# EAGLE design CCM_0020_transmitter (EAGLE 9.5.1)

## Sheet 1 of 2: transmitter
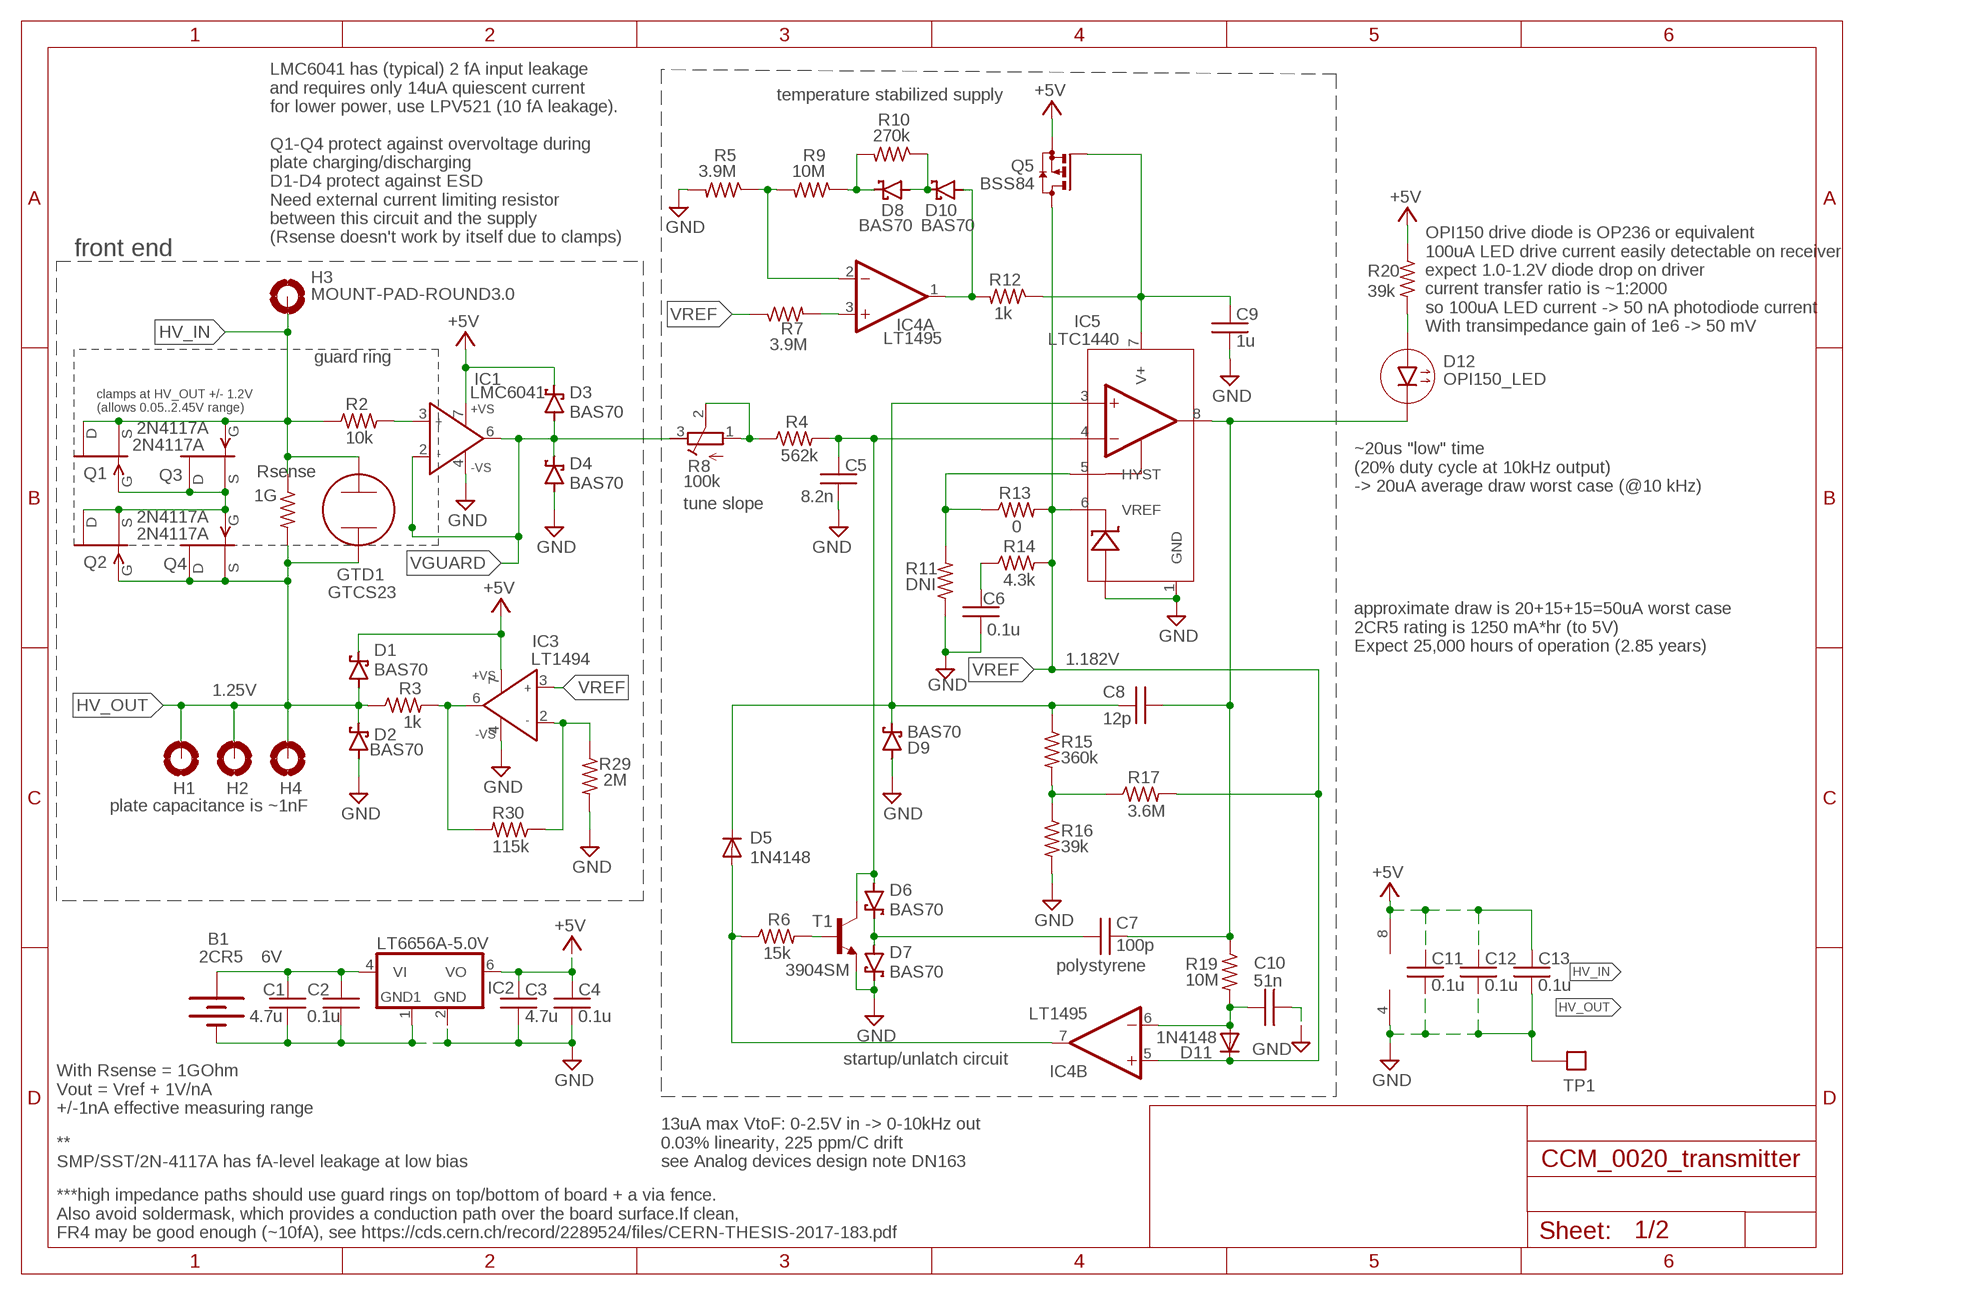
[diagram p0: schematic, sheet 1]

### Parts
B1  2CR5  BATTERY  [2CR5]
C1  4.7u  C0603  [0603]
C2  0.1u  C0603  [0603]
C3  4.7u  C0603  [0603]
C4  0.1u  C0603  [0603]
C5  8.2n  C0603  [0603]
C6  0.1u  C0603  [0603]
C7  100p  C0603  [0603]
C8  12p  C0603  [0603]
C9  1u  C0603  [0603]
C10  51n  C0603  [0603]
C11  0.1u  C0603  [0603]
C12  0.1u  C0603  [0603]
C13  0.1u  C0603  [0603]
D1  BAS70  [SOT23]
D2  BAS70  [SOT23]
D3  BAS70  [SOT23]
D4  BAS70  [SOT23]
D5  1N4148  [SOD323_ST]
D6  BAS70  [SOT23]
D7  BAS70  [SOT23]
D8  BAS70  [SOT23]
D9  BAS70  [SOT23]
D10  BAS70  [SOT23]
D11  1N4148  [SOD323_ST]
D12  OPI150_LED  [OPI150_LED]
GTD1  GTCS23  [GTCS23]
H1  MOUNT-PAD-ROUND3.0  [3,0-PAD]
H2  MOUNT-PAD-ROUND3.0  [3,0-PAD]
H3  MOUNT-PAD-ROUND3.0  [3,0-PAD]
H4  MOUNT-PAD-ROUND3.0  [3,0-PAD]
IC1  LMC6041  AD825_A  [SO08]
IC2  LT6656A-5.0V  LT6656  [SOT23-6]
IC3  LT1494  AD825_A  [SO08]
IC4  LT1495  LM393D  [SO08]
IC5  LTC1440  [SO8]
Q1  2N4117A  SST5484  [SOT23]
Q2  2N4117A  SST5484  [SOT23]
Q3  2N4117A  SST5484  [SOT23]
Q4  2N4117A  SST5484  [SOT23]
Q5  BSS84  [SOT23]
R1  1G  RESISTOR2512  [2512]
R2  10k  R0603  [0603]
R3  1k  R0603  [0603]
R4  562k  R0603  [0603]
R5  3.9M  R0603  [0603]
R6  15k  R0603  [0603]
R7  3.9M  R0603  [0603]
R8  100k  R-TRIMM3224W  [RTRIM3224W]
R9  10M  R0603  [0603]
R10  270k  R0603  [0603]
R11  DNI  R0603  [0603]
R12  1k  R0603  [0603]
R13  0  R0603  [0603]
R14  4.3k  R0603  [0603]
R15  360k  R0603  [0603]
R16  39k  R0603  [0603]
R17  3.6M  R0603  [0603]
R19  10M  R0603  [0603]
R20  39k  R0603  [0603]
R29  2M  R0603  [0603]
R30  115k  R0603  [0603]
T1  3904SM  [SOT23]
TP1  TESTPOINT  [TESTPOINT]

### Nets
+5V: C3.1 C4.1 C11.1 C12.1 C13.1 D1.3(C) D3.3(C) IC1.7(+VS) IC2.6(VO) IC3.7(+VS) IC4.8(P:V+) Q5.2(S) R20.1
GND: B1.V-(-) C1.2 C2.2 C3.2 C4.2 C5.2 C6.1 C9.2 C10.2 C11.2 C12.2 C13.2 D2.1(A) D4.1(A) D7.3(C) D9.1(A) IC1.4(-VS) IC2.1(GND1) IC2.2(GND) IC3.4(-VS) IC4.4(P:V-) IC5.1(GND) IC5.2(V-) R5.2 R11.1 R16.2 R29.2 T1.2(E) TP1.P$1
HV_IN: GTD1.P$1 H3.B3,0(MOUNT) Q1.1(D) Q1.2(S) Q3.3(G) R1.1 R2.1
HV_IN1: Q1.3(G) Q2.1(D) Q2.2(S) Q3.1(D) Q3.2(S) Q4.3(G)
HV_OUT: D1.1(A) D2.3(C) GTD1.P$2 H1.B3,0(MOUNT) H2.B3,0(MOUNT) H4.B3,0(MOUNT) Q2.3(G) Q4.1(D) Q4.2(S) R1.2 R3.1
HYST: IC5.5(HYST) R11.2 R13.1
N$2: C9.1 IC5.7(V+) Q5.1(G) R12.1
N$3: D12.P$1(1(A)) R20.2
N$6: R4.1 R8.1(A) R8.2(S)
N$7: IC1.3(IN+) R2.2
N$9: C6.2 R14.1
N$10: C5.1 D6.1(A) IC5.4(-IN) R4.2 T1.3(C)
N$11: C7.1 D6.3(C) D7.1(A)
N$12: R6.2 T1.1(B)
N$13: D5.A IC4.7(B:OUT) R6.1
N$14: R15.2 R16.1 R17.1
N$15: C8.1 D5.C D9.3(C) IC5.3(+IN) R15.1
N$16: C10.1 D11.A IC4.6(B:-IN) R19.2
N$18: D8.1(A) D10.3(C) R10.1
N$19: D8.3(C) R9.1 R10.2
N$20: IC4.2(A:-IN) R5.1 R9.2
N$22: B1.V+(+) C1.1 C2.1 IC2.4(VI)
N$23: D10.1(A) IC4.1(A:OUT) R12.2
N$25: IC4.3(A:+IN) R7.2
N$27: IC3.2(IN-) R29.1 R30.1
N$28: IC3.6(OUT) R3.2 R30.2
VGUARD: D3.1(A) D4.3(C) IC1.2(IN-) IC1.6(OUT) R8.3(E)
VREF: D11.C IC3.3(IN+) IC4.5(B:+IN) IC5.6(VREF) Q5.3(D) R7.1 R13.2 R14.2 R17.2
VTOF_OUTPUT: C7.2 C8.2 D12.P$2(2(C)) IC5.8(OUT) R19.1

### Notes on the sheet
- temperature stabilized supply
- LMC6041 has (typical) 2 fA input leakage
  and requires only 14uA quiescent current
  for lower power, use LPV521 (10 fA leakage).
  
  Q1-Q4 protect against overvoltage during 
  plate charging/discharging  
  D1-D4 protect against ESD
  Need external current limiting resistor
  between this circuit and the supply
  (Rsense doesn't work by itself due to clamps)
- front end
- OPI150 drive diode is OP236 or equivalent
  100uA LED drive current easily detectable on receiver
  expect 1.0-1.2V diode drop on driver
  current transfer ratio is ~1:2000
  so 100uA LED current -> 50 nA photodiode current
  With transimpedance gain of 1e6 -> 50 mV
- guard ring
- clamps at HV_OUT +/- 1.2V
  (allows 0.05..2.45V range)
- Rsense
- ~20us "low" time
  (20% duty cycle at 10kHz output)
  -> 20uA average draw worst case (@10 kHz)
- tune slope
- approximate draw is 20+15+15=50uA worst case
  2CR5 rating is 1250 mA*hr (to 5V)
  Expect 25,000 hours of operation (2.85 years)
- 1.182V
- 1.25V
- plate capacitance is ~1nF
- 6V
- polystyrene
- startup/unlatch circuit
- With Rsense = 1GOhm
  Vout = Vref + 1V/nA
  +/-1nA effective measuring range
- **
  SMP/SST/2N-4117A has fA-level leakage at low bias
- 13uA max VtoF: 0-2.5V in -> 0-10kHz out
  0.03% linearity, 225 ppm/C drift
  see Analog devices design note DN163
- ***high impedance paths should use guard rings on top/bottom of board + a via fence.  
  Also avoid soldermask, which provides a conduction path over the board surface.If clean, 
  FR4 may be good enough (~10fA), see https://cds.cern.ch/record/2289524/files/CERN-THESIS-2017-183.pdf

## Sheet 2 of 2: receiver
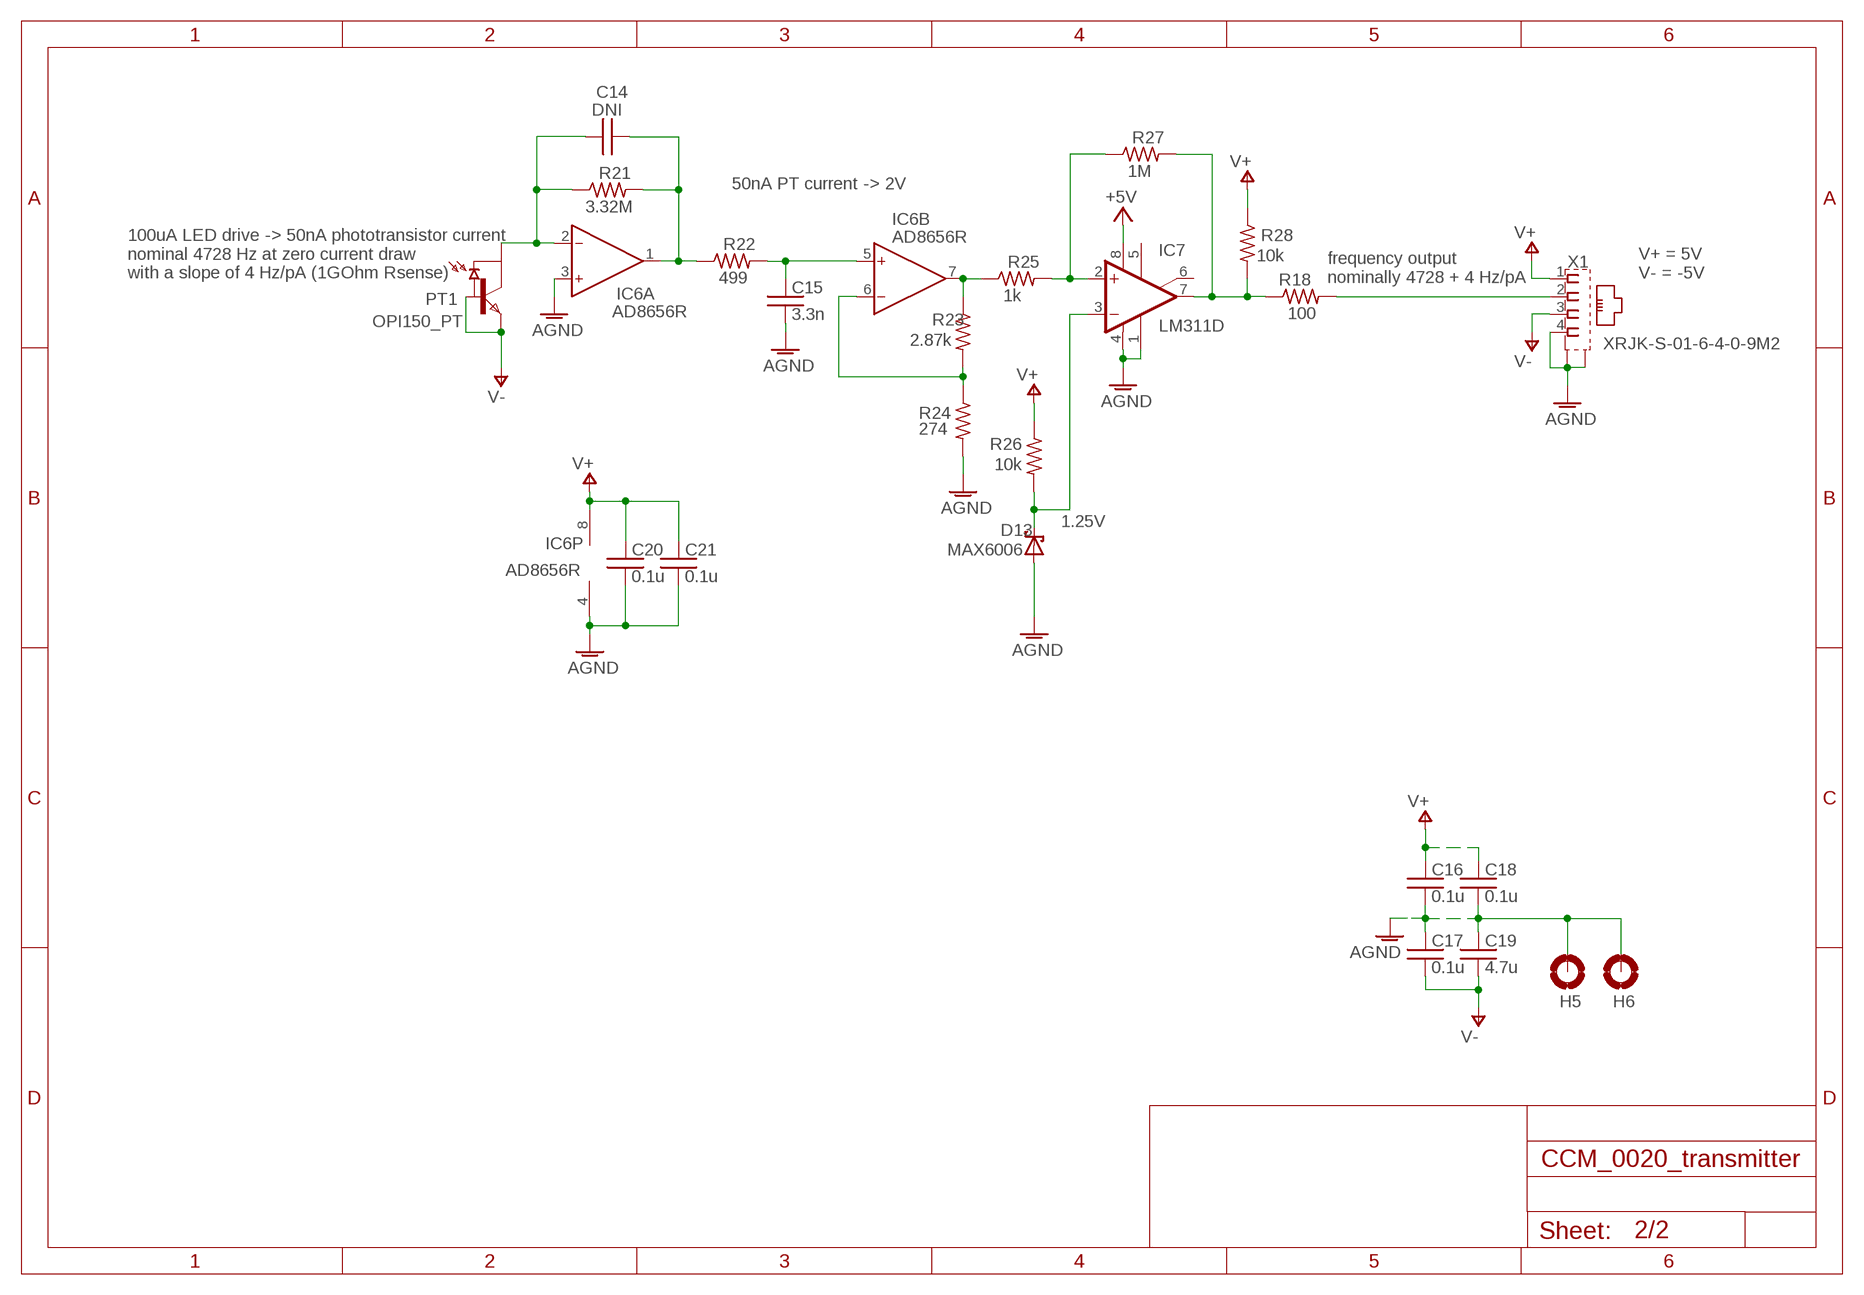
[diagram p1: schematic, sheet 2]

### Parts
C14  DNI  C0603  [0603]
C15  3.3n  C0603  [0603]
C16  0.1u  C0603  [0603]
C17  0.1u  C0603  [0603]
C18  0.1u  C0603  [0603]
C19  4.7u  C0603  [0603]
C20  0.1u  C0603  [0603]
C21  0.1u  C0603  [0603]
D13  MAX6006  LM4040  [SOT23]
H5  MOUNT-PAD-ROUND3.0  [3,0-PAD]
H6  MOUNT-PAD-ROUND3.0  [3,0-PAD]
IC6  AD8656R  [SO8]
IC7  LM311D  [SO08]
PT1  OPI150_PT  OPI150_PHOTOTRANSISTOR  [OPI150_PHOTOTRANSISTOR]
R18  100  R0603  [0603]
R21  3.32M  R0603  [0603]
R22  499  R0603  [0603]
R23  2.87k  R0603  [0603]
R24  274  R0603  [0603]
R25  1k  R0603  [0603]
R26  10k  R0603  [0603]
R27  1M  R0603  [0603]
R28  10k  R0603  [0603]
X1  XRJK-S-01-6-4-0-9M2  [XRJK-S-01-6-4-0-9M2]

### Nets
AGND: C15.2 C16.2 C17.1 C18.2 C19.1 C20.2 C21.2 D13.2(A) H5.B3,0(MOUNT) H6.B3,0(MOUNT) IC6.3(A:IN+) IC6.4(P:V-) IC7.1(GND) IC7.4(V-) R24.2 X1.4 X1.S1(S) X1.S2(S)
FOUT: IC7.7(OUT) R18.1 R27.2 R28.2
N$1: R18.2 X1.2
N$4: C14.1 IC6.2(A:IN-) PT1.P3(COLLECTOR) R21.1
N$5: C14.2 IC6.1(A:OUT) R21.2 R22.1
N$8: C15.1 IC6.5(B:IN+) R22.2
N$17: IC6.6(B:IN-) R23.2 R24.1
N$21: IC6.7(B:OUT) R23.1 R25.1
N$24: IC7.2(+IN) R25.2 R27.1
N$26: D13.1(C) IC7.3(-IN) R26.2
V+: C16.1 C18.1 C20.1 C21.1 IC6.8(P:V+) IC7.8(V+) R26.1 R28.1 X1.1 ; supply symbol labelled +5V
V-: C17.2 C19.2 PT1.P4(BASE) PT1.P5(EMITTER) X1.3
Unconnected: IC7.5(ON) IC7.6(ON/STR)

### Notes on the sheet
- 50nA PT current -> 2V
- 100uA LED drive -> 50nA phototransistor current
  nominal 4728 Hz at zero current draw
  with a slope of 4 Hz/pA (1GOhm Rsense)
- V+ = 5V
  V- = -5V
- frequency output
  nominally 4728 + 4 Hz/pA
- 1.25V

## Library data of the parts
B1 = noah:BATTERY
C1-C21 = acrooptics:C: Capacitor
D1-D4 D6-D10 = diode:BAS70: Silicon Schottky Diodes General-purpose diode for high-speed switching
D5 D11 = custom_parts:1N4148: DIODE high speed (Philips)
D12 = noah:OPI150_LED
D13 = noah:LM4040: LM4040 Reference Zener Diode
GTD1 = noah:GTCS23
H1-H6 = holes:MOUNT-PAD-ROUND: MOUNTING PAD, round
IC1 IC3 = noah:AD825_A: Low Cost, General-Purpose High Speed JFET Amplifier Source: http://www.analog.com/static/imported-files/data_sheets/AD825.pdf
IC2 = noah:LT6656
IC4 = linear:LM393: COMPARATOR
IC5 = noah:LTC1440
IC6 = analog-devices:AD8656: Low Noise, Precision CMOS Amplifier Source: http://www.analog.com/static/imported-files/data_sheets/AD8655_8656.pdf; MPN: AD8656ARZ; OC_FARNELL: 1117887; OC_NEWARK: 19M0993
IC7 = linear:LM311: COMPARATOR
PT1 = noah:OPI150_PHOTOTRANSISTOR
Q1-Q4 = transistor-fet:?548*: N-Channel JFETs Source: VISHAY 2N5484.pdf Compatible: TO92 2N5245 J304 J305 U310 J308 J309 J310 TO72 2N4416 2N4416A 2N3823 2N4351 3N169 3N170 3N171 MFE3002 TO18 2N3796 2N3797 MFE825 Source: Motorola European Master Guide Pacge 3-59
Q5 = transistor-small-signal:BSS84: P-CHANNEL MOS FET
R1 = noah:RESISTOR: RESISTOR, American symbol
R2-R7 R9-R30 = acrooptics:R: 0603 resistor
R8 = rcl:R-TRIMM: Trimm resistor; SPICEMODEL: X; SPICEPREFIXL: POT
T1 = noah:3904: NPN TRANSISTOR
TP1 = noah:TESTPOINT
X1 = con-xmultiple:XRJK*4: RJ11 Connector without LED, 6 position, 4 contacts, thrue hole Source: XRJK-S-01-6-4-0-9M2(01).pdf

## Net classes
1 standard: width 0.61 mm, clearance 0.254 mm
2 shield: width 0.61 mm, clearance 0.635 mm

## Board
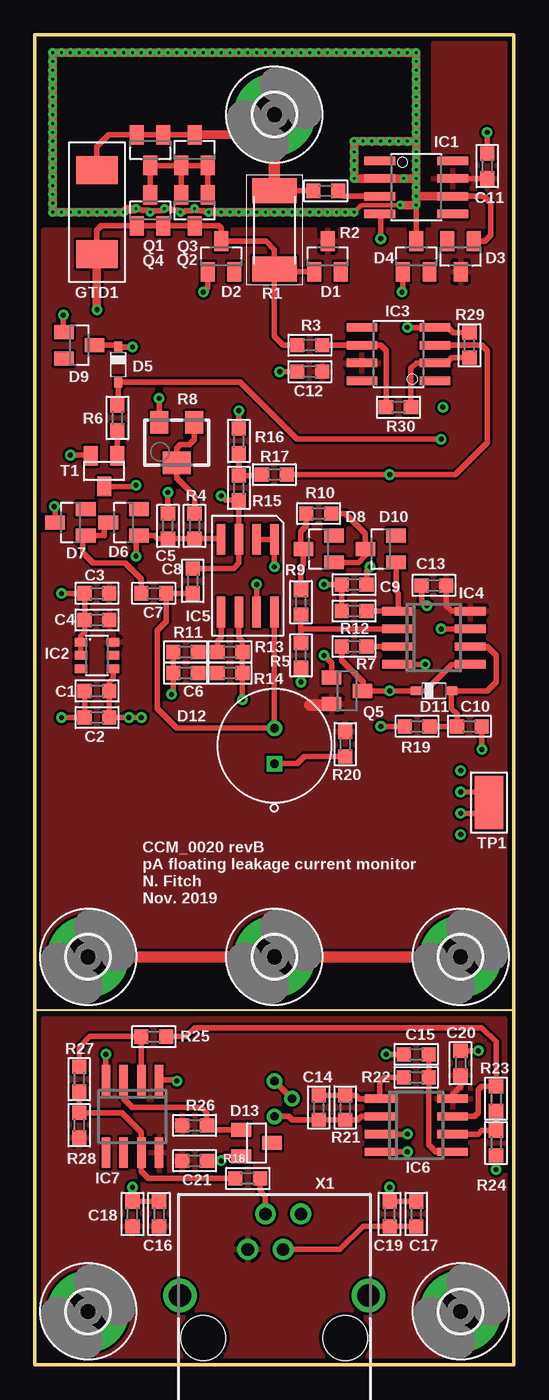
[diagram p2: board, top side]
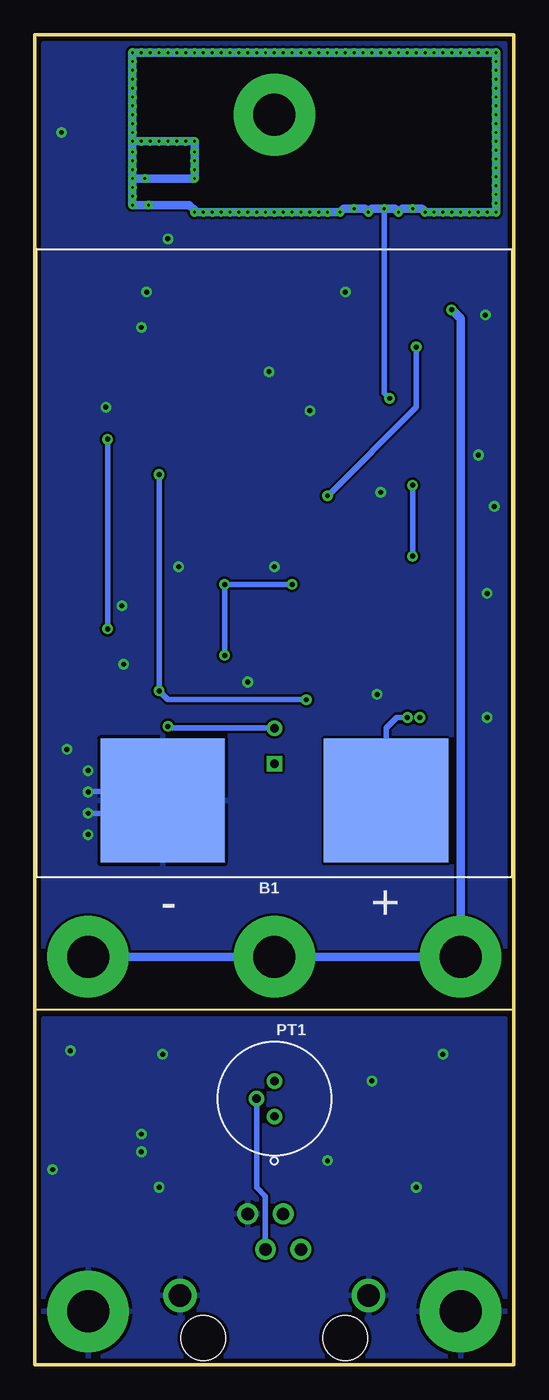
[diagram p3: board, bottom side, seen from below]

Size 34.29 x 95.25 mm. Coordinates in mm from the lower left corner, seen from the top.
Outline: 0,25.4 0,95.25 34.29,95.25 34.29,25.4
Outline: 0,25.4 0,0 34.29,0 34.29,25.4
Outline: 0,25.4 34.29,25.4
Copper layers (1*16): Top 0.035mm / dielectric 1.5mm / Bottom 0.035mm
Design rules "default *": minimum track width 10mil, minimum drill 8mil, track to track 7mil, track to pad 7mil, pad to pad 7mil, via to via 7mil, smd to smd 7mil, copper to edge 10mil, drill to drill 8mil, minimum pad ring 10mil, minimum via ring 8mil, stop-mask expansion 4mil, vias tented up to drill 0mil, thermal gap 10mil

### Footprints (pad centres in the part's own frame; a part is rotated, then mirrored left to right if it is on the bottom)
2CR5 = smd 8.89 x 8.89: V+ -8,17; V- 8,17
0603 = smd 1.016 x 1.016: 1 -0.889,0; 2 0.889,0
SOT23 = smd 1 x 1.4: 1 -0.95,-1.1; 2 0.95,-1.1; 3 0,1.1
SOD323_ST = smd 0.8 x 0.6: A 1.25,0; C -1.25,0
OPI150_LED = drill 0.6 square: P$1 0,1.27 | drill 0.6: P$2 0,-1.27
GTCS23 = smd 2 x 3: P$1 -3,0; P$2 3,0
3,0-PAD = drill 3 pad 5.842: B3,0 0,0
SO08 = smd 0.61 x 2.21: 1 -1.905,-2.616; 2 -0.635,-2.616; 3 0.635,-2.616; 4 1.905,-2.616; 5 1.905,2.616; 6 0.635,2.616; 7 -0.635,2.616; 8 -1.905,2.616
SOT23-6 = smd 0.6 x 0.9: 1 -0.95,-1.15; 2 0,-1.15; 3 0.95,-1.15; 4 0.95,1.15; 5 0,1.15; 6 -0.95,1.15
SO08' = smd 0.6 x 2.2: 1 -1.905,-2.6; 2 -0.635,-2.6; 3 0.635,-2.6; 4 1.905,-2.6; 5 1.905,2.6; 6 0.635,2.6; 7 -0.635,2.6; 8 -1.905,2.6
SO8 = smd 0.6 x 2.2: 1 -1.905,-2.6; 2 -0.635,-2.6; 3 0.635,-2.6; 4 1.905,-2.6; 5 1.905,2.6; 6 0.635,2.6; 7 -0.635,2.6; 8 -1.905,2.6
OPI150_PHOTOTRANSISTOR = drill 0.6: P3 0,1.27; P4 1.27,0; P5 0,-1.27
2512 = smd 1.8 x 3.2: 1 -2.8,0; 2 2.8,0
RTRIM3224W = smd 1.3 x 1.6: 1 -1.25,-1.45; 3 1.25,-1.45 | smd 2 x 1.6: 2 0,1.45
TESTPOINT = smd 3.81 x 2.032: P$1 0,0
XRJK-S-01-6-4-0-9M2 = drill 0.9 pad 1.5: 1 -1.905,6.35; 2 -0.635,8.89; 3 0.635,6.35; 4 1.905,8.89 | drill 1.6 pad 2.184: S1 -6.75,3.05; S2 6.75,3.05 | hole 3.2: -5.08,0; 5.08,0

### Placement (x,y rotation side)
B1  17.14,57.4 180 bottom
C1  4.45,48.26 180 top
C2  4.45,46.35 180 top
C3  4.45,55.24 180 top
C4  4.45,53.34 180 top
C5  9.53,60.07 90 top
C6  10.79,49.53 0 top
C7  8.51,55.24 0 top
C8  11.3,56.13 270 top
C9  22.86,55.88 0 top
C10  31.11,45.72 0 top
C11  32.38,85.85 90 top
C12  19.68,71.12 180 top
C13  28.57,55.82 180 top
C14  20.32,18.41 90 top
C15  27.3,22.22 180 top
C16  8.89,10.79 90 top
C17  27.3,10.79 270 top
C18  6.99,10.79 90 top
C19  25.4,10.79 270 top
C20  30.48,21.59 90 top
C21  11.43,14.6 0 top
D1  20.95,79.38 0 top
D2  13.34,79.38 0 top
D3  30.48,79.38 180 top
D4  27.3,79.38 0 top
D5  5.97,71.63 270 top
D6  6.35,60.32 90 top
D7  2.54,60.32 90 top
D8  20.32,58.42 90 top
D9  3.17,73.03 270 top
D10  24.77,58.42 90 top
D11  28.57,48.26 0 top
D12  17.14,44.32 180 top
D13  15.88,15.87 270 top
GTD1  4.45,82.55 270 top
H1  30.48,29.21 0 top
H2  3.81,29.21 0 top
H3  17.14,89.53 0 top
H4  17.14,29.21 0 top
H5  30.48,3.81 0 top
H6  3.81,3.81 0 top
IC1  27.3,84.33 270 top
IC2  4.45,50.8 270 top
IC3  26.04,72.39 90 top
IC4  LT1495  [SO08']  28.57,52.07 270 top
IC5  15.24,56.52 180 top
IC6  27.3,17.14 270 top
IC7  LM311D  [SO08']  6.99,17.78 180 top
PT1  17.14,19.05 180 bottom
Q1  8.26,87 180 top
Q2  11.43,82.68 180 top
Q3  11.43,87 0 top
Q4  8.26,82.68 0 top
Q5  22.35,48.26 270 top
R1  17.14,81.28 270 top
R2  20.83,84.07 0 top
R3  19.68,73.03 0 top
R4  11.43,60.07 270 top
R5  19.05,50.8 270 top
R6  5.91,67.82 270 top
R7  22.86,51.44 0 top
R8  10.16,66.04 180 top
R9  19.05,54.61 270 top
R10  20.32,60.96 180 top
R11  10.79,51.05 0 top
R12  22.86,53.97 0 top
R13  13.97,51.05 0 top
R14  13.97,49.53 0 top
R15  14.61,62.8 90 top
R16  14.61,66.17 90 top
R17  17.14,63.75 0 top
R18  15.24,13.33 0 top
R19  27.37,45.72 0 top
R20  22.23,44.45 270 top
R21  22.23,18.41 90 top
R22  27.3,20.57 0 top
R23  33.02,19.05 270 top
R24  33.02,15.87 270 top
R25  8.51,23.49 180 top
R26  11.43,17.14 0 top
R27  3.17,20.45 270 top
R28  3.17,17.14 90 top
R29  31.11,73.03 90 top
R30  26.04,68.58 180 top
T1  4.95,64.01 180 top
TP1  32.51,40.26 90 top
X1  17.14,1.9 0 top

### Tracks (layer width: path | path; a pad name or v marks a point on that pad's centre or on a via)
+5V
  Top 0.406: C13.1 29.46,54.36 29.84,53.97 IC4.8 | IC1.7 C11.1
  Top 0.813: Q5.2 21.19,47.24 19.68,47.24
  pour Top: 0.64,26.04 0.64,81.28 28.57,81.28 28.57,94.62 33.66,94.62 33.66,26.04
AGND  (via drill 0.35)
  Top 0.406: D13.2 13.65,14.92 v13.34,14.6 C21.2 | R24.2 v33.02,13.97 | C20.2 v31.75,22.48 | IC6.3 v26.67,16.51 | IC6.4 v26.67,15.24 | C17.1 C19.1 v25.4,12.7 | C16.2 C18.2 v6.99,12.7 | IC7.1 10.1,20.38 v10.16,20.32 | IC7.4 v5.08,22.22 | C15.2 v25.15,22.22
  pour Bottom: 0.64,0.63 0.64,24.76 33.66,24.76 33.66,0.63
FOUT
  Top 0.406: R27.2 R28.2 6.22,18.03 7.62,16.64 IC7.7 7.62,13.84 8.13,13.33 R18.1
GND  (via drill 0.35)
  Top 0.406: IC4.4 v27.94,50.16 | IC1.4 24.77,82.35 v24.77,80.64 | C10.2 v32,44.07 | C1.2 C2.2 v1.91,46.35 | v1.91,55.24 C3.2 C4.2 3.56,52.45 3.29,52.19 IC2.1 IC2.2 | C5.2 v9.53,62.48 | R11.1 C6.1 9.91,48.13 v9.78,48.01 | IC5.2 IC5.1 v17.14,57.15 | R16.2 v14.61,68.33 | v26.67,74.3 IC3.4 29.59,74.3 29.97,73.91 R29.2 | T1.2 3.96,65.15 v2.54,65.15 | v1.4,61.47 1.44,61.42 D7.3 | C9.2 23.75,56.9 v24,57.15 | C13.2 27.69,54.74 v28.07,54.36 | R5.2 v19.05,48.89 | v30.48,41.02 32.51,41.02 TP1.P$1 32.51,39.5 v30.48,39.5 | C11.2 v32.38,88.27 | D4.1 26.36,76.9 v26.29,76.84 | 12.21,78.1 D2.1 12.38,77.16 v12.06,76.84 | C12.2 v17.53,71.12 | D9.1 2.03,74.02 v2.03,75.18
  Bottom 0.406: v30.48,41.02 30.46,41.04 25.78,41.04 B1.V- 25.3,39.5 v30.48,39.5
  other vias: 30.48,42.55 30.48,37.97 29.21,68.58
  pour Bottom: 0.64,26.04 0.64,94.62 33.66,94.62 33.66,81.28 33.66,26.04
HV_IN
  Top 0.406: Q3.3 Q1.1 Q1.2 5.29,88.09 4.45,87.25 GTD1.P$1 | R1.1 R2.1
  Top 0.61: Q3.3 15.71,88.09 H3.B3,0
  Top 0.813: H3.B3,0 R1.1
HV_IN1
  Top 0.406: Q4.3 Q1.3 Q3.1 | Q3.1 Q2.2 | Q2.1 Q3.2 Q3.1
HV_OUT  (via drill 0.35)
  Top 0.406: GTD1.P$2 4.45,81.28 4.74,81.58 Q4.1 Q4.2 Q2.3 13.16,81.58 13.34,81.41 D2.3 16.55,80.47 17.14,79.88 R1.2 | D1.1 17.35,78.28 R1.2 | R3.1 17.78,73.03 17.14,73.66 R1.2
  Top 0.61: v4.45,75.56 GTD1.P$2
  Top 0.813: H1.B3,0 H4.B3,0 H2.B3,0
  Bottom 0.61: v4.45,75.56 3.81,74.93 H2.B3,0 H4.B3,0 H1.B3,0
HYST
  Top 0.406: IC5.5 13.34,52.07 13.08,51.82 R13.1 R11.2
N$1
  Top 0.406: R18.2 16.13,12.45 16.51,12.06 X1.2
N$2  (via drill 0.35)
  Top 0.406: R12.1 C9.1 v20.7,55.88 | Q5.1 21.25,50.25 v20.7,50.8 | v15.88,55.88 IC5.7
  Bottom 0.406: v20.7,50.8 v20.7,55.88 v15.88,55.88
N$3
  Top 0.406: D12.P$1 18.8,43.05 19.3,43.56 R20.2
N$4
  Top 0.406: PT1.P3 18.16,17.78 18.41,17.53 C14.1 R21.1 23.11,17.53 23.37,17.78 IC6.2
N$5
  Top 0.406: C14.2 R21.2 22.99,19.3 23.24,19.05 IC6.1 24.7,20.26 25.02,20.57 R22.1
N$6
  Top 0.406: R8.1 11.41,66.27 11.05,65.91 10.41,65.91 10.16,65.66 R8.2 10.16,63.5 11.43,62.23 R4.1
N$7
  Top 0.406: IC1.3 22.1,83.69 R2.2
N$8
  Top 0.406: C15.1 R22.2 28.19,15.75 28.7,15.24 IC6.5
N$9
  Top 0.406: R14.1 C6.2
N$10  (via drill 0.35)
  Top 0.406: IC5.4 13.27,59.18 R4.2 C5.1 8.76,59.18 8.57,59.38 D6.1 7.64,59.18 7.39,59.18 7.24,59.03 v7.24,57.91 | T1.3 7.16,62.91 v7.24,62.99
  Bottom 0.406: v7.24,62.99 v7.24,57.91
N$11
  Top 0.406: D6.3 4.95,60.03 4.95,59.38 D7.1 3.43,59.16 3.43,58.17 4.19,57.4 6.48,57.4 7.62,56.26 C7.1
N$12
  Top 0.406: R6.2 T1.1
N$13  (via drill 0.35)
  Top 0.406: IC4.7 v29.08,52.7 | v29.08,66.29 18.8,66.29 14.71,70.38 D5.A 5.97,68.77 R6.1
  Bottom 0.406: v29.08,66.29 v29.08,52.7
N$14
  Top 0.406: R16.1 R15.2 16.19,63.69 R17.1
N$15  (via drill 0.35)
  Top 0.406: C8.1 14.22,57.02 14.61,57.4 IC5.3 R15.1 13.65,61.91 v13.34,62.23 | D9.3 5.82,73.03 D5.C 5.99,72.9 v6.99,72.9
  Bottom 0.406: v6.99,72.9 6.99,68.58 v13.34,62.23
N$16
  Top 0.406: IC4.6 32.38,51.44 33.02,50.8 33.02,48.89 32.38,48.26 D11.A 29.82,47.01 30.23,46.61 C10.1 R19.2
N$17
  Top 0.406: R23.2 R24.1 32,16.76 31.75,16.51 IC6.6
N$18
  Top 0.406: D8.1 23.18,57.47 23.66,57.95 D10.3 23.66,59.52 22.23,60.96 R10.1
N$19
  Top 0.406: R9.1 19.05,57.15 19.22,57.32 D8.3 19.05,58.59 19.05,59.69 19.43,60.07 R10.2
N$20
  Top 0.406: R9.2 19.05,52.7 | 19.05,52.7 R5.1 | IC4.2 19.05,52.7
N$21
  Top 0.406: IC6.7 31.5,17.78 31.75,18.03 31.75,19.68 32,19.94 R23.1 33.02,23.11 32,24.13 11.43,24.13 10.79,23.49 R25.1
N$22  (via drill 0.35)
  Top 0.406: IC2.4 5.59,49.16 5.33,48.89 C1.1 C2.1 v6.73,46.35 v7.62,46.35
  Bottom 0.406: v7.62,46.35 8.38,46.35 9.14,45.59 B1.V+
N$23
  Top 0.406: R12.2 IC4.1 26.04,54.03 26.04,55.24 25.86,55.41 D10.1
N$24
  Top 0.406: IC7.2 R25.2 3.94,23.49 3.17,22.73 R27.1
N$25
  Top 0.406: IC4.3 R7.2
N$26
  Top 0.406: D13.1 12.64,16.82 R26.2 12.32,18.03 11.94,18.41 6.99,18.41 6.35,19.05 IC7.3
N$27
  Top 0.406: R29.1 29.84,72.14 29.46,71.75 IC3.2 27.3,71.75 26.92,71.37 R30.1
N$28
  Top 0.406: R3.2 IC3.6 24.77,73.03 25.15,72.64 R30.2
V+
  Top 0.406: IC6.8 29.91,19.36 30.48,19.94 C20.1
  pour Top: 0.64,24.76 33.66,24.76 33.66,0.63 0.64,0.63
V-
  Top 0.406: PT1.P5 PT1.P4 | X1.3 21.84,8.25 23.5,9.91 C19.2 C17.2
  Bottom 0.406: PT1.P4 18.41,12.7 17.78,12.06 X1.3
VGUARD  (via drill 0.2, 0.2 pad 0.51, 0.2 pad 0.55, 0.35)
  Top 0.305: v26.16,83.06 23.37,83.06 v22.86,82.55
  Top 0.406: v7.24,82.8 7.49,82.8 7.6,82.7 8.11,82.7 v8.26,82.55 8.44,82.55 8.55,82.66 9.12,82.66 v9.27,82.8 9.71,82.8 9.82,82.7 10.27,82.7 v10.41,82.55 10.66,82.55 10.77,82.66 11.28,82.66 v11.43,82.8 11.58,82.66 12.09,82.66 12.2,82.55 v12.45,82.55 | v21.59,82.55 v22.86,82.55 | D4.3 v27.3,83.06 | IC1.6 32.13,83.69 32.64,83.19 32.64,80.9 32.22,80.47 D3.1 | v8.89,69.22 8.89,67.51 R8.3
  Top 0.61: IC1.6 v27.3,83.69 | v5.08,82.55 v3.81,82.55 | v3.81,82.55 v1.91,82.55 v1.27,82.55 v1.27,83.19 v1.27,83.82 v1.27,84.45 v1.27,85.09 v1.27,85.72 v1.27,86.36 v1.27,87 v1.27,87.63 v1.27,88.27 v1.27,88.9 v1.27,89.53 v1.27,90.17 v1.27,90.81 v1.27,91.44 v1.27,92.07 v1.27,92.71 v1.27,93.34 v1.27,93.98 v1.91,93.98 v2.54,93.98 v3.17,93.98 v3.81,93.98 v4.45,93.98 v5.08,93.98 v5.71,93.98 v6.35,93.98 v6.99,93.98 v7.62,93.98 v8.26,93.98 v8.89,93.98 v9.53,93.98 v10.16,93.98 v10.79,93.98 v11.43,93.98 v12.06,93.98 v12.7,93.98 v13.34,93.98 v13.97,93.98 v14.61,93.98 v15.24,93.98 v15.88,93.98 v16.51,93.98 v17.14,93.98 v17.78,93.98 v18.41,93.98 v19.05,93.98 v19.68,93.98 v20.32,93.98 v20.95,93.98 v21.59,93.98 v22.23,93.98 v22.86,93.98 v23.5,93.98 v24.13,93.98 v24.77,93.98 v25.4,93.98 v26.04,93.98 v26.67,93.98 v27.3,93.98 v27.3,93.34 v27.3,92.71 v27.3,92.07 v27.3,91.44 v27.3,90.81 v27.3,90.17 v27.3,89.53 v27.3,88.9 v27.3,88.27 v27.3,87.63 | v3.81,82.55 v3.17,82.55 | v5.08,82.55 v4.45,82.55 | v22.86,84.96 IC1.2 v26.42,84.96 v27.3,84.96 | v22.86,84.96 v22.86,86.23 v22.86,86.87 v22.86,87.63 v23.5,87.63 v24.13,87.63 v24.77,87.63 v25.4,87.63 v26.04,87.63 v26.67,87.63 v27.3,87.63 | v22.86,85.6 v22.86,84.96 | v26.16,83.06 v27.3,83.06 v27.3,83.69 | v27.3,84.96 v27.3,84.33 v27.3,83.69 | v27.3,84.96 v27.3,85.6 v27.3,86.23 v27.3,86.87 v27.3,87.63 | v5.08,82.55 v5.71,82.55 v6.35,82.55 6.4,82.55 6.61,82.76 7.2,82.76 v7.24,82.8 | v12.45,82.55 v13.34,82.55 v13.97,82.55 v14.61,82.55 v15.24,82.55 v15.88,82.55 v16.51,82.55 v17.14,82.55 v17.78,82.55 v18.41,82.55 v19.05,82.55 v19.68,82.55 v20.32,82.55 v20.95,82.55 v21.59,82.55 v22.23,82.55 v22.86,82.55
  Bottom 0.406: v9.27,82.8 9.27,69.6 v8.89,69.22
  Bottom 0.61: v3.81,82.55 v2.54,82.55 v1.91,82.55 v1.27,82.55 v1.27,83.19 v1.27,83.82 v1.27,84.45 v1.27,85.09 v1.27,85.72 v1.27,86.36 v1.27,87 v1.27,87.63 v1.27,88.27 v1.27,88.9 v1.27,89.53 v1.27,90.17 v1.27,90.81 v1.27,91.44 v1.27,92.07 v1.27,92.71 v1.27,93.34 v1.27,93.98 v1.91,93.98 v2.54,93.98 v3.81,93.98 v4.45,93.98 v5.08,93.98 v6.35,93.98 | v6.35,93.98 v6.99,93.98 v7.62,93.98 v8.26,93.98 v8.89,93.98 v9.53,93.98 v10.16,93.98 v10.79,93.98 v11.43,93.98 v12.06,93.98 v12.7,93.98 v13.34,93.98 v13.97,93.98 v14.61,93.98 v15.24,93.98 v15.88,93.98 v16.51,93.98 v17.14,93.98 v17.78,93.98 v18.41,93.98 v19.05,93.98 v19.68,93.98 v20.32,93.98 v20.95,93.98 v21.59,93.98 v22.23,93.98 v22.86,93.98 v23.5,93.98 v24.13,93.98 v24.77,93.98 v25.4,93.98 v26.04,93.98 v26.67,93.98 v27.3,93.98 v27.3,93.34 v27.3,92.71 v27.3,92.07 v27.3,91.44 v27.3,90.81 v27.3,90.17 v27.3,89.53 v27.3,88.9 v27.3,88.27 v27.3,87.63 | v5.08,82.55 v3.81,82.55 | v5.08,82.55 v4.45,82.55 | v3.81,82.55 v3.17,82.55 | v27.3,87.63 v22.86,87.63 v22.86,84.96 v26.42,84.96 v27.3,84.96 | v5.71,93.98 v6.35,93.98 | v27.3,87.63 v27.3,86.87 v27.3,86.23 v27.3,85.6 v27.3,84.96 | v27.3,84.96 v27.3,84.33 v27.3,83.69 v27.3,83.06 v26.16,83.06 23.24,83.06 22.86,82.68 v22.86,82.55 v22.23,82.55 v21.59,82.55 v20.95,82.55 v20.32,82.55 v19.68,82.55 v19.05,82.55 v18.41,82.55 v17.78,82.55 v17.14,82.55 v16.51,82.55 v15.88,82.55 v15.24,82.55 v14.61,82.55 v13.97,82.55 v13.34,82.55 v12.45,82.55 12.19,82.8 v11.43,82.8 10.67,82.8 v10.41,82.55 10.16,82.8 v9.27,82.8 8.51,82.8 v8.26,82.55 8,82.8 v7.24,82.8 6.6,82.8 v6.35,82.55 v5.71,82.55 v5.08,82.55
VREF  (via drill 0.35)
  Top 0.406: R7.1 21.97,50.42 23.5,48.89 23.5,48.3 Q5.3 v25.4,48.26 | 23.54,48.26 D11.C 27.94,48.26 29.84,50.16 IC4.5 | IC5.6 14.61,52.07 14.86,51.82 R13.2 R14.2 v14.86,47.62 | IC3.3 32,73.03 32.38,72.64 32.38,66.04 30.1,63.75 v25.4,63.75 R17.2
  Top 0.61: 23.54,48.26 Q5.3
  Bottom 0.406: v14.86,47.62 24.77,47.62 v25.4,48.26 v25.4,63.75
VTOF_OUTPUT  (via drill 0.35)
  Top 0.406: IC5.8 D12.P$2 10.16,45.59 8.76,46.99 8.76,52.58 9.4,53.21 C7.2 C8.2 | R19.1 v24.77,45.72
  Bottom 0.406: v24.77,45.72 24.64,45.59 D12.P$2

### Text on the board
tPlace: CCM_0020 revB / pA floating leakage current monitor / N. Fitch / Nov. 2019